# EAGLE design 01 (EAGLE 8.7.0)
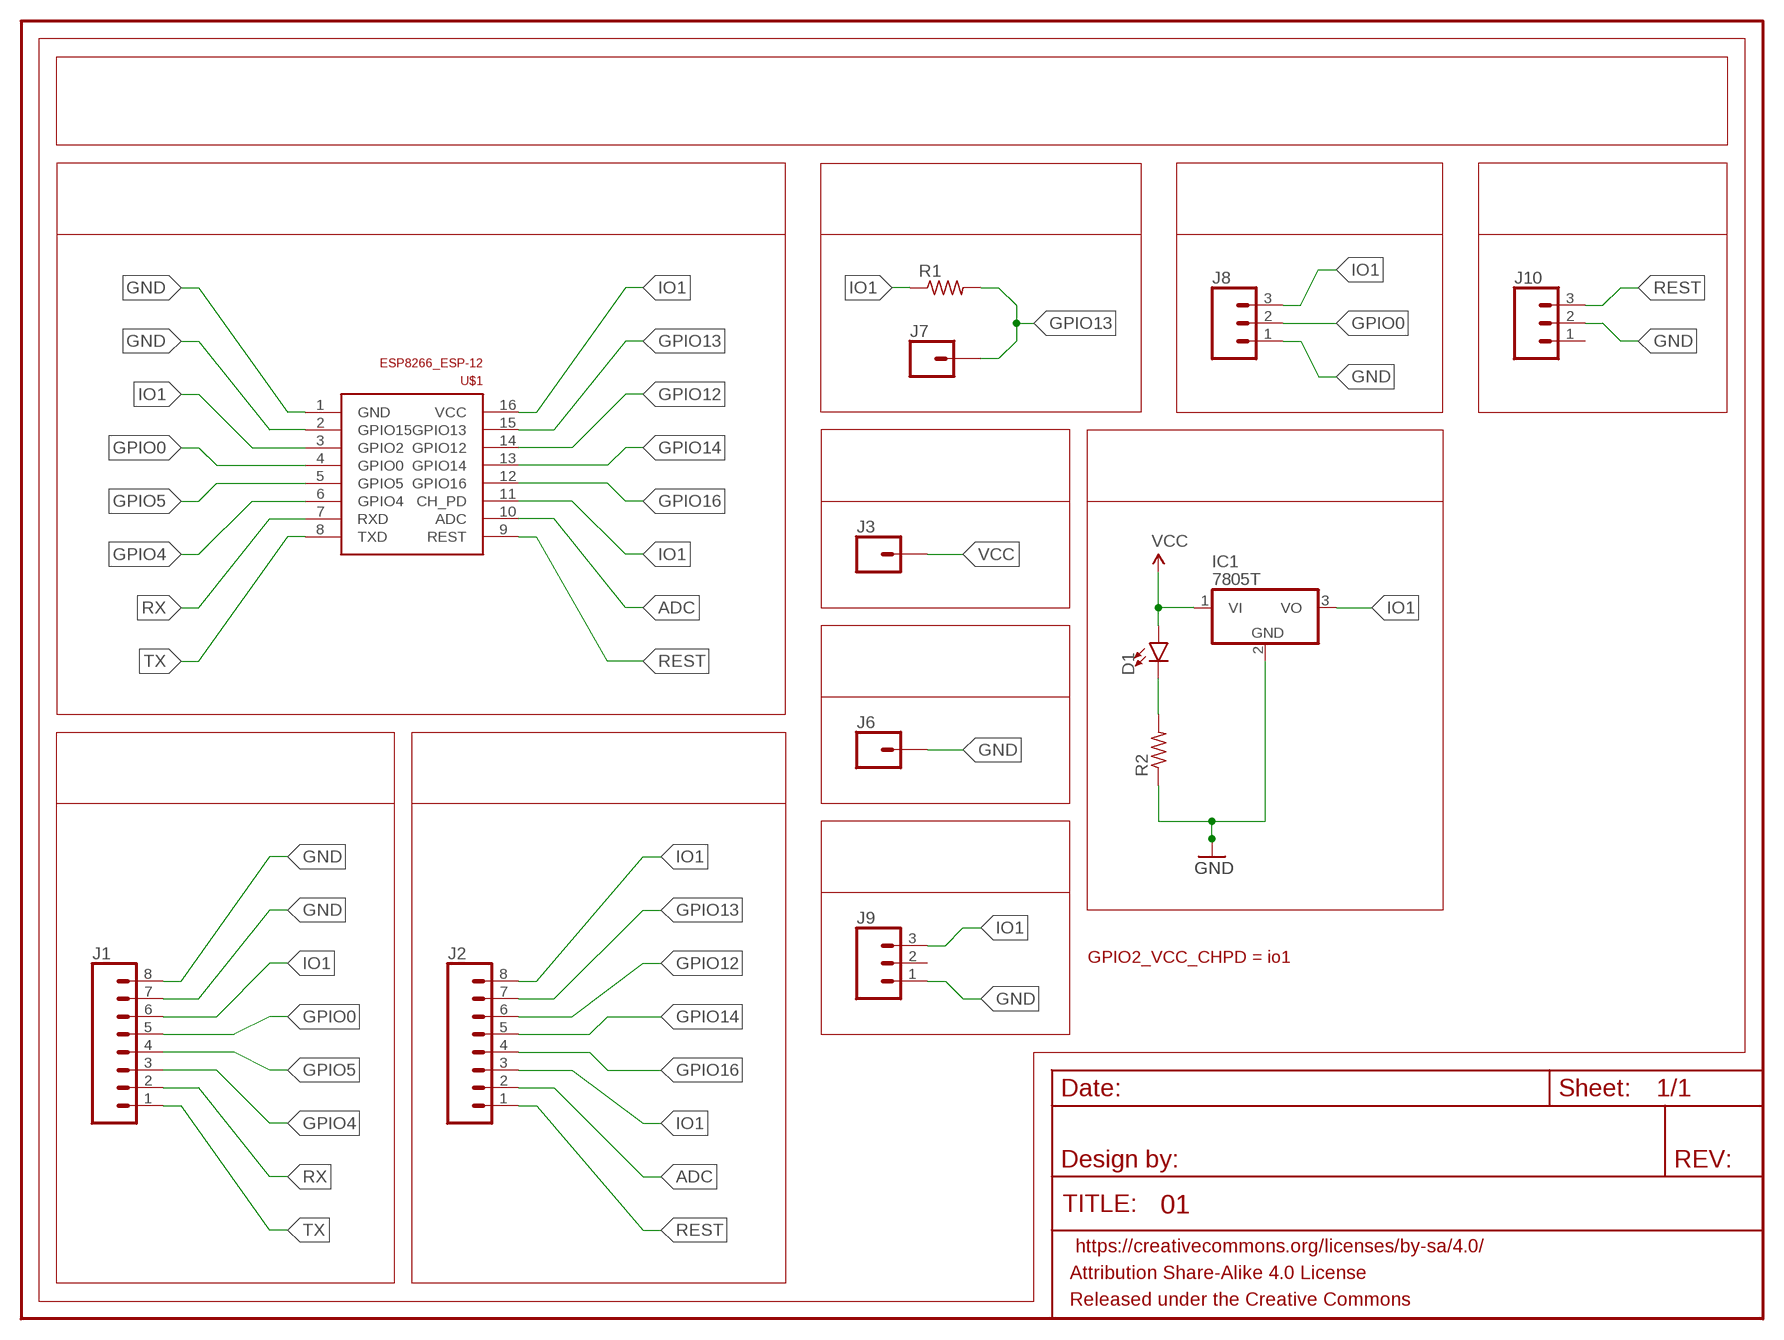
[diagram p0: schematic, sheet 1]

## Parts
D1  LED5MM  [LED_5MM]
FRAME1  FRAME-LETTER  [CREATIVE_COMMONS]
IC1  7805T  [TO220H]
J1  CONN_08LONGPADS  [1X08_LONGPADS]
J2  CONN_08LONGPADS  [1X08_LONGPADS]
J3  CONN_01PTH_LONGPAD  [1X01_LONGPAD]
J6  CONN_01PTH_LONGPAD  [1X01_LONGPAD]
J7  CONN_01PTH_LONGPAD  [1X01_LONGPAD]
J8  CONN_03LONGPADS  [1X03_LONGPADS]
J9  CONN_03LONGPADS  [1X03_LONGPADS]
J10  CONN_03LONGPADS  [1X03_LONGPADS]
R1  R-US_0204/7  [0204/7]
R2  R-US_0204/7  [0204/7]
U$1  ESP8266_ESP-12  [ESP8266-ESP12]

## Nets
ADC: J2.2 U$1.10(ADC)
GND: IC1.2(GND) J1.7 J1.8 J6.1 J8.1 J9.1 J10.2 R2.1 U$1.1(GND) U$1.2(GPIO15)
GPIO0: J1.5 J8.2 U$1.4(GPIO0)
GPIO4: J1.3 U$1.6(GPIO4)
GPIO5: J1.4 U$1.5(GPIO5)
GPIO12: J2.6 U$1.14(GPIO12)
GPIO13: J2.7 J7.1 R1.2 U$1.15(GPIO13)
GPIO14: J2.5 U$1.13(GPIO14)
GPIO16: J2.4 U$1.12(GPIO16)
IO1: IC1.3(VO) J1.6 J2.3 J2.8 J8.3 J9.3 R1.1 U$1.3(GPIO2) U$1.11(CH_PD) U$1.16(VCC)
N$2: D1.K(C) R2.2
REST: J2.1 J10.3 U$1.9(REST)
RX: J1.2 U$1.7(RXD)
TX: J1.1 U$1.8(TXD)
VCC: D1.A IC1.1(VI) J3.1
Unconnected: J9.2 J10.1

## Notes on the sheet
- GPIO2_VCC_CHPD = io1

## Library data of the parts
D1 = SparkFun-LED:LED: LED (Generic) Standard schematic elements and footprints for 5mm, 3mm, 1206, and 0603 sized LEDs. Generic LEDs with no color specified.
FRAME1 = SparkFun-Aesthetics:FRAME-LETTER: Schematic Frame - Letter Standard 8.5x11 US Letter frame
IC1 = linear:78*: Positive VOLTAGE REGULATOR Source: http://cache.national.com/ds/LM/LM78L05.pdf http://www.fairchildsemi.com/ds/LM/LM7805.pdf
J1 J2 = SparkFun-Connectors:CONN_08: Multi connection point. Often used as Generic Header-pin footprint for 0.1 inch spaced/style header connections On any of the 0.1 inch spaced packages, you can populate with these: Break Away Headers - Straight <https://www.sparkfun.com/products/116> (PRT-00116) Break Away Male Headers - Right Angle <https://www.sparkfun.com/products/553> (PRT-00553) Female Headers <https://www.sparkfun.com/products/115> (PRT-00115) Break Away Headers - Machine Pin <https://www.sparkfun.com/products/117> (PRT-00117) Break Away Female Headers - Swiss Machine Pin <https://www.sparkfun.com/products/743> (PRT-00743) Arduino Stackable Header - 8 Pin <https://www.sparkfun.com/products/9279> (PRT-09279) For SCREWTERMINALS and SPRING TERMINALS visit here: Screw Terimnals on SparkFun.com <https://www.sparkfun.com/search/results?term=Screw+Terminals> (5mm/3.5mm/2.54mm spacing) This device is also useful as a general connection point to wire up your design to another part of your project. Our various solder wires solder well into these plated through hole pads. Hook-Up Wire - Assortment (Stranded, 22 AWG) <https://www.sparkfun.com/products/11375> (PRT-11375) Hook-Up Wire - Assortment (Solid Core, 22 AWG) <https://www.sparkfun.com/products/11367> (PRT-11367) View the entire wire category on our website here <https://www.sparkfun.com/categories/141> Special notes: Molex polarized connector foot print use with SKU : PRT-08231 with associated crimp pins and housings. 1MM SMD Version SKU: PRT-10208 NOTES ON THE VARIANTS LOCK and LOCK_LONGPADS... This footprint was designed to help hold the alignment of a through-hole component (i.e. 6-pin header) while soldering it into place. You may notice that each hole has been shifted either up or down by 0.005 of an inch from it's more standard position (which is a perfectly straight line). This slight alteration caused the pins (the squares in the middle) to touch the edges of the holes. Because they are alternating, it causes a "brace" to hold the component in place. 0.005 has proven to be the perfect amount of "off-center" position when using our standard breakaway headers. Although looks a little odd when you look at the bare footprint, once you have a header in there, the alteration is very hard to notice. Also,if you push a header all the way into place, it is covered up entirely on the bottom side.
J3 J6 J7 = SparkFun-Connectors:CONN_01: Single connection point. Often used as Generic Header-pin footprint for 0.1 inch spaced/style header connections On any of the 0.1 inch spaced packages, you can populate with these: Break Away Headers - Straight <https://www.sparkfun.com/products/116> (PRT-00116) Break Away Male Headers - Right Angle <https://www.sparkfun.com/products/553> (PRT-00553) Female Headers <https://www.sparkfun.com/products/115> (PRT-00115) Break Away Headers - Machine Pin <https://www.sparkfun.com/products/117> (PRT-00117) Break Away Female Headers - Swiss Machine Pin <https://www.sparkfun.com/products/743> (PRT-00743) This device is also useful as a general connection point to wire up your design to another part of your project. Our various solder wires solder well into these plated through hole pads. Hook-Up Wire - Assortment (Stranded, 22 AWG) <https://www.sparkfun.com/products/11375> (PRT-11375) Hook-Up Wire - Assortment (Solid Core, 22 AWG) <https://www.sparkfun.com/products/11367> (PRT-11367) View the entire wire category on our website here <https://www.sparkfun.com/categories/141> Special notes: SMTSO-256-ET is a "flush mount" nut for a 4-40 screw. We mostly use this on specialty testbeds; it is a nice way to connect hardware to your PCB at an adjustable hieght. Also note, the SNAP packages are for using a snappable style connector. We sell a baggie of snaps and they are also used on two LilyPad designs: Snap Assortment - 30 pack (male and female) <https://www.sparkfun.com/products/11347> (DEV-11347) LilyPad Arduino SimpleSnap <https://www.sparkfun.com/products/10941> (DEV-10941) LilyPad SimpleSnap Protoboard <https://www.sparkfun.com/products/10940> (DEV-10940)
J8-J10 = SparkFun-Connectors:CONN_03: Multi connection point. Often used as Generic Header-pin footprint for 0.1 inch spaced/style header connections On any of the 0.1 inch spaced packages, you can populate with these: Break Away Headers - Straight <https://www.sparkfun.com/products/116> (PRT-00116) Break Away Male Headers - Right Angle <https://www.sparkfun.com/products/553> (PRT-00553) Female Headers <https://www.sparkfun.com/products/115> (PRT-00115) Break Away Headers - Machine Pin <https://www.sparkfun.com/products/117> (PRT-00117) Break Away Female Headers - Swiss Machine Pin <https://www.sparkfun.com/products/743> (PRT-00743) Stackable Header - 3 Pin (Female, 0.1") <https://www.sparkfun.com/products/13875> (PRT-13875) For SCREWTERMINALS and SPRING TERMINALS visit here: Screw Terimnals on SparkFun.com <https://www.sparkfun.com/search/results?term=Screw+Terminals> (5mm/3.5mm/2.54mm spacing) This device is also useful as a general connection point to wire up your design to another part of your project. Our various solder wires solder well into these plated through hole pads. Hook-Up Wire - Assortment (Stranded, 22 AWG) <https://www.sparkfun.com/products/11375> (PRT-11375) Hook-Up Wire - Assortment (Solid Core, 22 AWG) <https://www.sparkfun.com/products/11367> (PRT-11367) View the entire wire category on our website here <https://www.sparkfun.com/categories/141> Special notes: Molex polarized connector foot print use with SKU : PRT-08232 with associated crimp pins and housings.
R1 R2 = resistor:R-US_: RESISTOR, American symbol
U$1 = ESP8266-ESP12:ESP8266_ESP-12

## Board
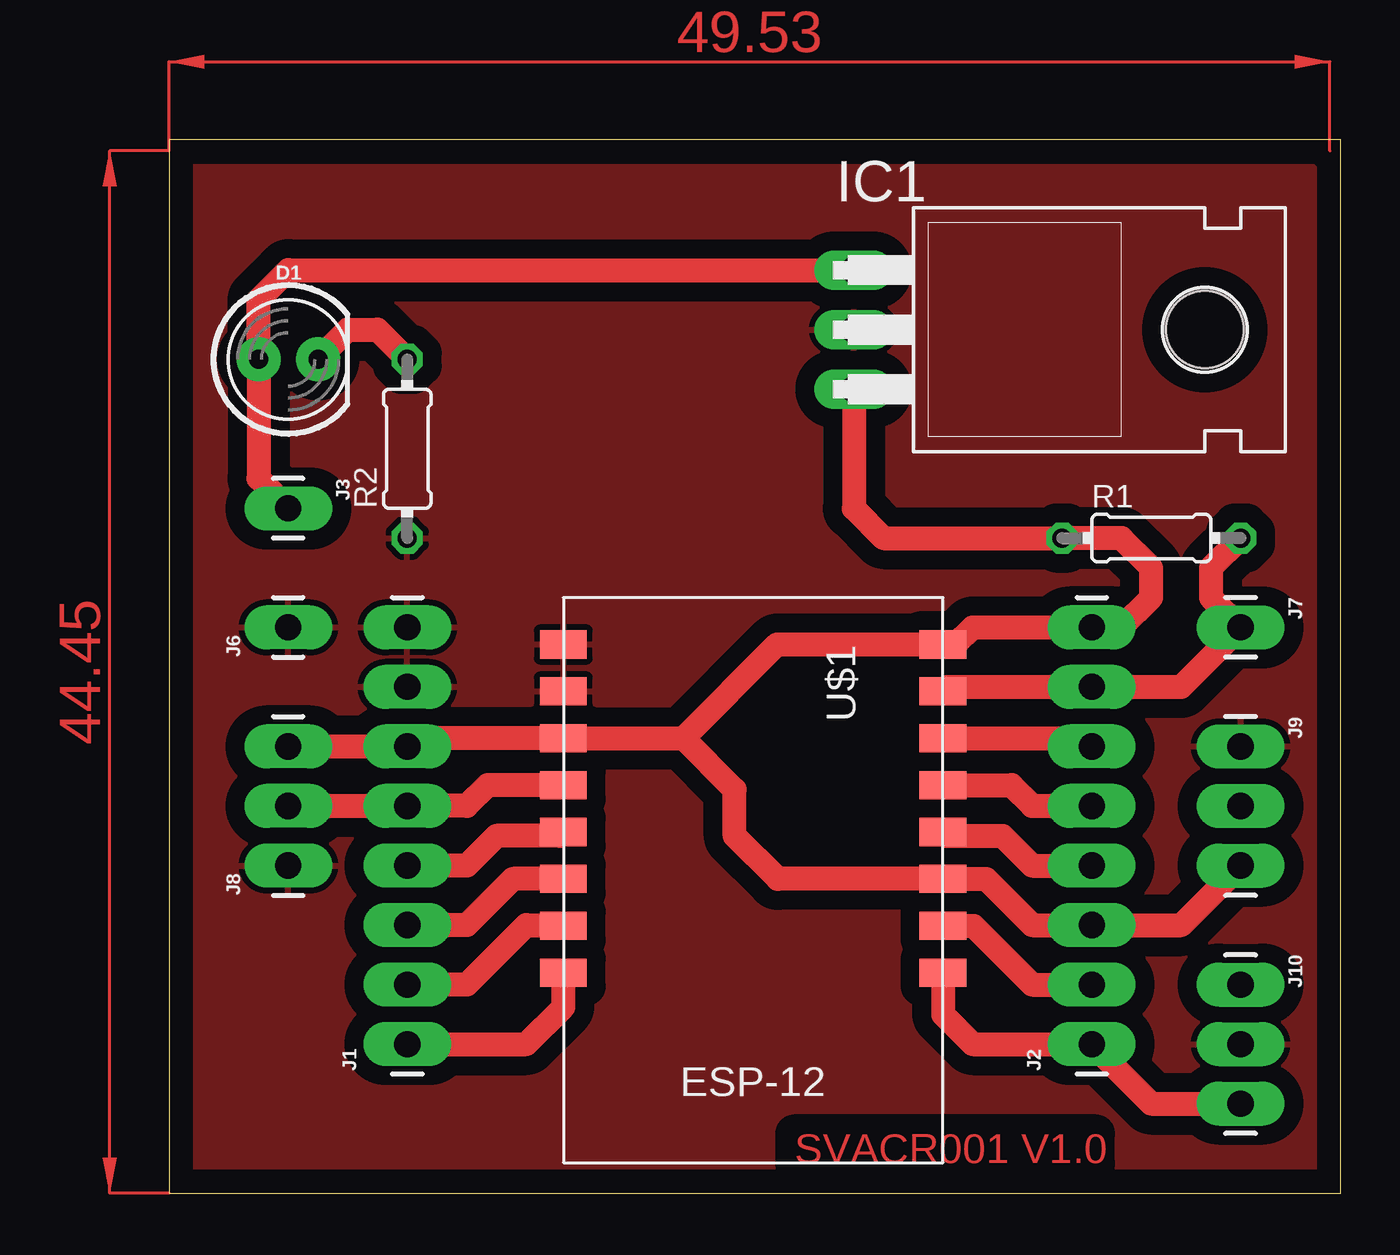
[diagram p1: board, top side]
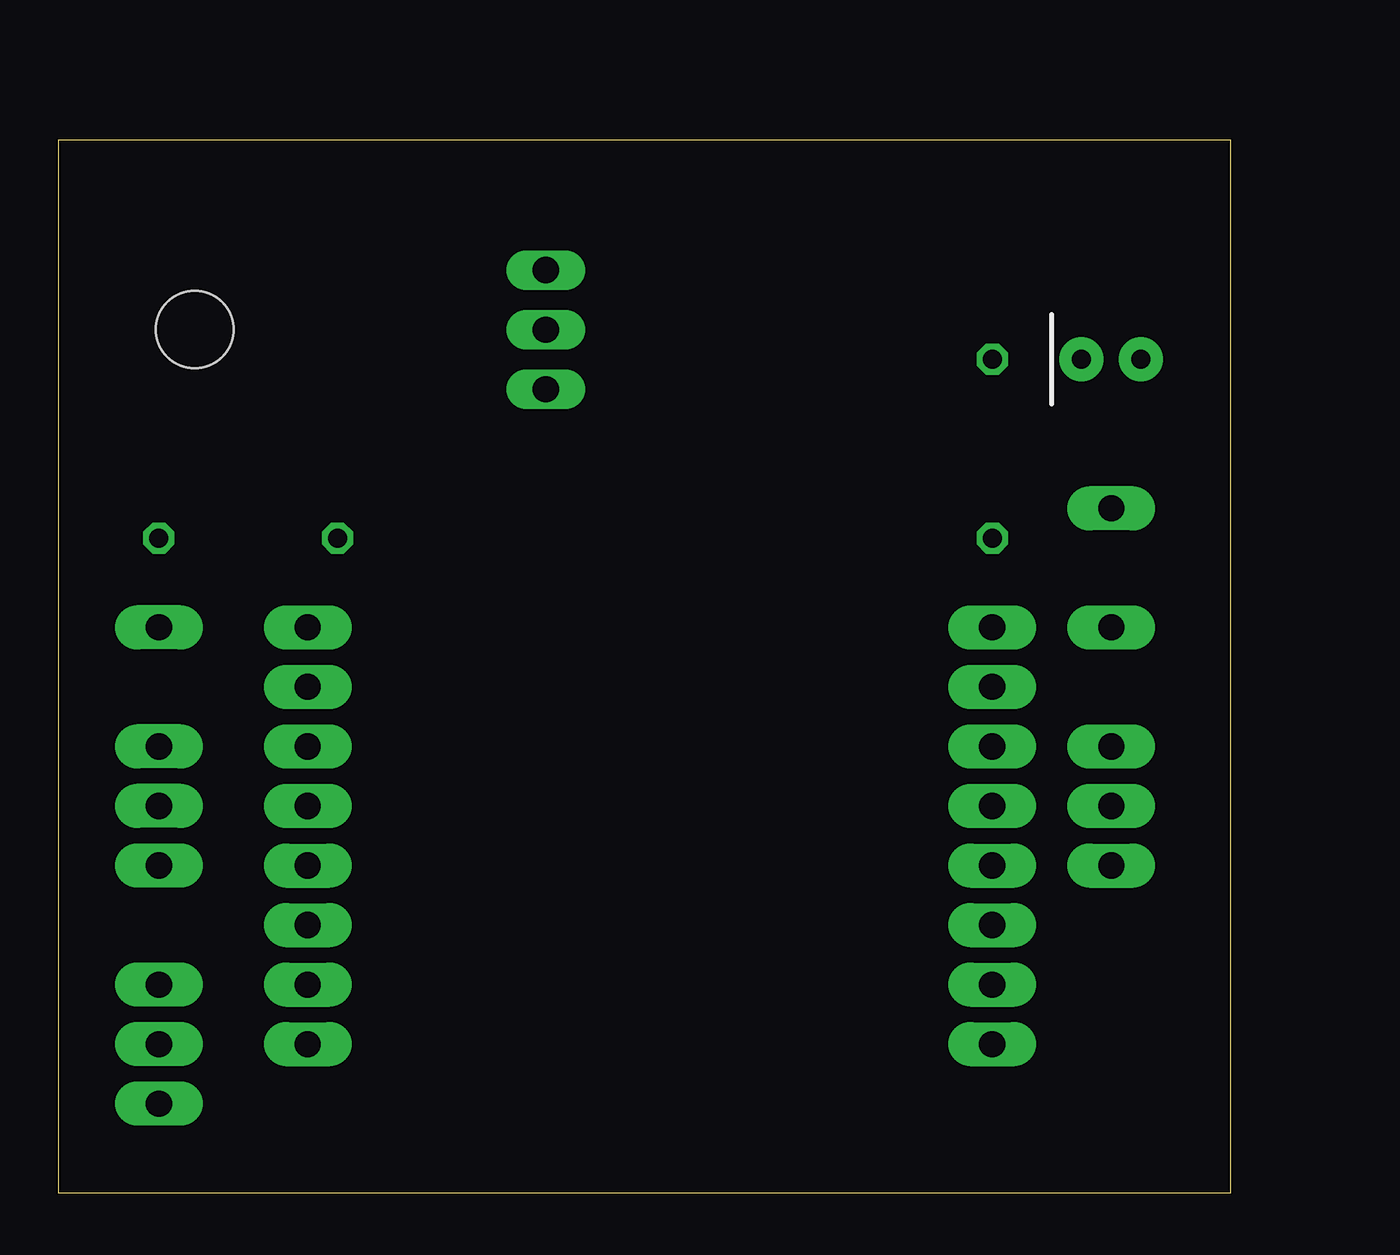
[diagram p2: board, bottom side, seen from below]

Size 50 x 44.92 mm. Coordinates in mm from the lower left corner, seen from the top.
Outline: 0,0 50,0 50,44.92 0,44.92 0,0
Copper layers (1*16): Top 0.035mm / dielectric 1.5mm / Bottom 0.035mm
Design rules "default": minimum track width 6mil, minimum drill 0.35mm, track to track 6mil, track to pad 6mil, pad to pad 6mil, via to via 6mil, smd to smd 6mil, copper to edge 40mil, drill to drill 6mil, minimum pad ring 10mil, minimum via ring 8mil, stop-mask expansion 4mil, vias tented up to drill 0mil, thermal gap 10mil

### Footprints (pad centres in the part's own frame; a part is rotated, then mirrored left to right if it is on the bottom)
LED_5MM = drill 0.813 pad 1.88: A -1.27,0; K 1.27,0
TO220H = drill 1.118 long: 1 -2.54,-10.16; 2 0,-10.16; 3 2.54,-10.16 | hole 3.302: 0,4.826
1X08_LONGPADS = drill 1.118 pad 1.88 long: 1 0,0; 2 2.54,0; 3 5.08,0; 4 7.62,0; 5 10.16,0; 6 12.7,0; 7 15.24,0; 8 17.78,0
1X01_LONGPAD = drill 1.118 pad 1.88 long: 1 0,0
1X03_LONGPADS = drill 1.118 pad 1.88 long: 1 0,0; 2 2.54,0; 3 5.08,0
0204/7 = drill 0.813 octagon: 1 -3.81,0; 2 3.81,0
ESP8266-ESP12 = smd 2 x 1.2: 1 16.2,2; 2 16.2,4; 3 16.2,6; 4 16.2,8; 5 16.2,10; 6 16.2,12; 7 16.2,14; 8 16.2,16; 9 0,16; 10 0,14; 11 0,12; 12 0,10; 13 0,8; 14 0,6; 15 0,4; 16 0,2

### Placement (x,y rotation side)
D1  5.08,35.56 0 top
FRAME1  0,-8.89 0 top  (outside the outline)
IC1  39.37,36.83 270 top
J1  10.16,6.35 90 top
J2  39.37,6.35 90 top
J3  5.08,29.21 270 top
J6  5.08,24.13 90 top
J7  45.72,24.13 270 top
J8  5.08,13.97 90 top
J9  45.72,19.05 270 top
J10  45.72,8.89 270 top
R1  41.91,27.94 0 top
R2  10.16,31.75 90 top
U$1  33.02,25.4 180 top

### Tracks (layer width: path | path; a pad name or v marks a point on that pad's centre or on a via)
ADC
  Top 1.016: U$1.10 34.32,11.4 36.83,8.89 J2.2
GND
  pour Top (isolate 0.813): 0,0 0,44.45 49.53,44.45 49.53,0
GPIO0
  Top 1.016: J8.2 J1.5 12.7,16.51 13.59,17.4 U$1.4
GPIO4
  Top 1.016: U$1.6 14.67,13.4 12.7,11.43 J1.3
GPIO5
  Top 1.016: U$1.5 16.66,15.24 13.97,15.24 12.7,13.97 J1.4
GPIO12
  Top 1.016: U$1.14 39.02,19.4 J2.6
GPIO13
  Top 1.016: U$1.15 33.21,21.59 J2.7 43.18,21.59 J7.1 44.45,25.4 44.45,26.67 R1.2
GPIO14
  Top 1.016: U$1.13 35.94,17.4 36.83,16.51 J2.5
GPIO16
  Top 1.016: U$1.12 33.18,15.24 35.56,15.24 36.83,13.97 J2.4
IO1
  Top 1.016: J8.3 J1.6 10.51,19.4 U$1.3 21.94,19.4 | 21.94,19.4 25.94,23.4 U$1.16 33.56,23.4 34.29,24.13 J2.8 40.64,24.13 41.91,25.4 41.91,26.67 40.64,27.94 R1.1 30.48,27.94 29.21,29.21 IC1.3 | J9.3 43.18,11.43 J2.3 36.83,11.43 34.86,13.4 U$1.11 25.97,13.4 24.13,15.24 24.13,17.21 21.94,19.4
N$2
  Top 1.016: D1.K 7.62,36.83 8.89,36.83 R2.2
REST
  Top 1.016: U$1.9 33.02,7.62 34.29,6.35 J2.1 41.91,3.81 J10.3
RX
  Top 1.016: U$1.7 15.27,11.4 15.24,11.43 12.7,8.89 J1.2
TX
  Top 1.016: J1.1 15.24,6.35 16.82,7.93 U$1.8
VCC
  Top 1.016: J3.1 3.81,30.48 D1.A 3.81,38.1 5.08,39.37 IC1.1
(copper drawn outside any net)
  shapes: Top area x2

### Text on the board
Top: SVACR001 V1.0